# Altium schematic sheet sense_temperature.SchDoc: Sense Temperature
size A4; Date: 27.05.2014; Author: Stefan Lüthi; DrawnBy: Author; Organization: BFH; Address1: Bern University of Applied Sciences; Address2: Engineering and Information Technology; Address3: Jlcoweg 1; Address4: CH-3400 Burgdorf; DocumentNumber: 1; Revision: 1.0; SheetNumber: 3; SheetTotal: 8; CurrentDate: 27.05.2014
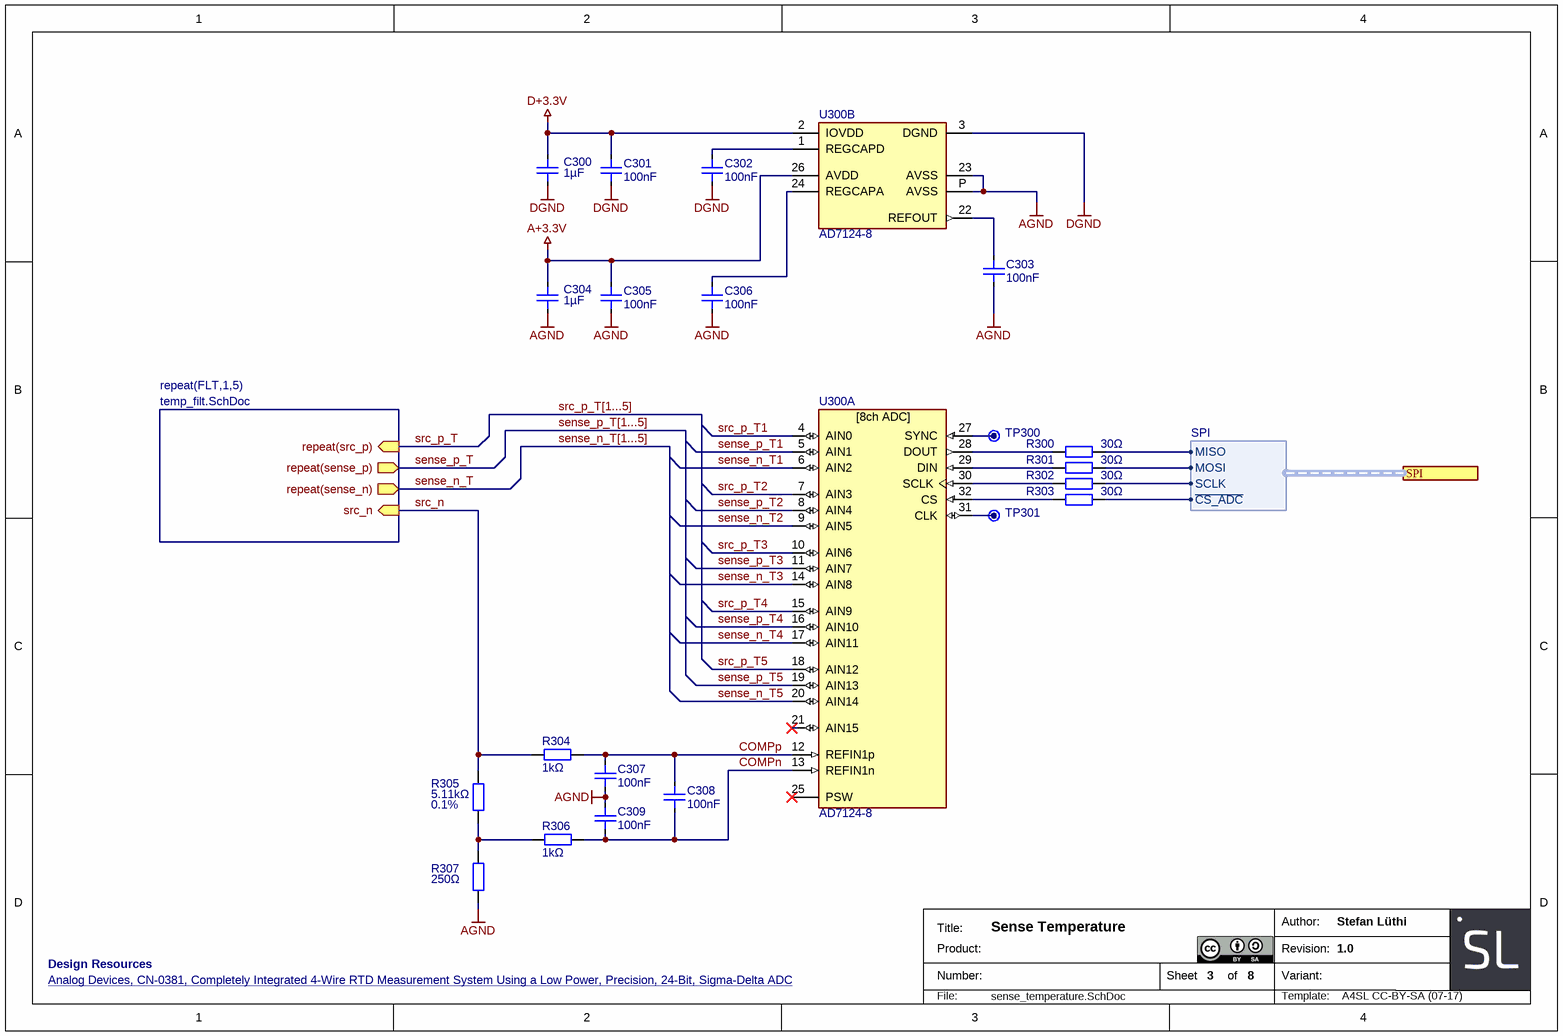
[diagram p0: sense_temperature.SchDoc]

## Parts
C300  1µF  [SMD0603CAP]
C301  100nF  [SMD0603CAP]
C302  100nF  [SMD0603CAP]
C303  100nF  [SMD0603CAP]
C304  1µF  [SMD0603CAP]
C305  100nF  [SMD0603CAP]
C306  100nF  [SMD0603CAP]
C307  100nF  [SMD0603CAP]
C308  100nF  [SMD0603CAP]
C309  100nF  [SMD0603CAP]
R300  30Ω  [SMD0603RES]
R301  30Ω  [SMD0603RES]
R302  30Ω  [SMD0603RES]
R303  30Ω  [SMD0603RES]
R304  1kΩ  [SMD0603RES]
R305  5.11kΩ  precision: 0.1%  [SMD0603RES]
R306  1kΩ  [SMD0603RES]
R307  250Ω  [SMD0603RES]
TP300  Testpoint  [TP]  (value not drawn)  (no BOM)
TP301  Testpoint  [TP]  (value not drawn)  (no BOM)
U300  AD7124-8  [QFN32]  (parts A,B of 2)

## Sub-sheets
repeat(FLT,1,5) = temp_filt.SchDoc: repeat(sense_n) (out), repeat(src_p) (in), src_n (in), repeat(sense_p) (out)

## Ports
SPI (harness SPI)

## Harnesses
SPI: MISO, MOSI, SCLK, ~{CS_ADC}

## Nets
A+3.3V: C304.1 C305.1 U300.26(AVDD)
AGND: C303.2 C304.2 C305.2 C306.2 C307.2 C309.1 R307.1 U300.23(AVSS) U300.P(AVSS)
D+3.3V: C300.1 C301.1 U300.2(IOVDD)
DGND: C300.2 C301.2 C302.2 U300.3(DGND)
COMPn: C308.2 C309.2 R306.1 U300.13(REFIN1n)
COMPp: C307.1 C308.1 R304.1 U300.12(REFIN1p)
sense_n_T: sheet repeat(FLT,1,5)/repeat(sense_n)
sense_n_T1: U300.6(AIN2)
sense_n_T2: U300.9(AIN5)
sense_n_T3: U300.14(AIN8)
sense_n_T4: U300.17(AIN11)
sense_n_T5: U300.20(AIN14)
sense_p_T: sheet repeat(FLT,1,5)/repeat(sense_p)
sense_p_T1: U300.5(AIN1)
sense_p_T2: U300.8(AIN4)
sense_p_T3: U300.11(AIN7)
sense_p_T4: U300.16(AIN10)
sense_p_T5: U300.19(AIN13)
src_n: R304.2 R305.1 ; sheet repeat(FLT,1,5)/src_n
src_p_T: sheet repeat(FLT,1,5)/repeat(src_p)
src_p_T1: U300.4(AIN0)
src_p_T2: U300.7(AIN3)
src_p_T3: U300.10(AIN6)
src_p_T4: U300.15(AIN9)
src_p_T5: U300.18(AIN12)
NetC302_1: C302.1 U300.1(REGCAPD)
NetC303_1: C303.1 U300.22(REFOUT)
NetC306_1: C306.1 U300.24(REGCAPA)
NetR300_1: R300.1 ; port SPI.MISO
NetR300_2: R300.2 U300.28(DOUT)
NetR301_1: R301.1 ; port SPI.MOSI
NetR301_2: R301.2 U300.29(DIN)
NetR302_1: R302.1 ; port SPI.SCLK
NetR302_2: R302.2 U300.30(SCLK)
NetR303_1: R303.1 ; port SPI.~{CS_ADC}
NetR303_2: R303.2 U300.32(CS)
NetR305_2: R305.2 R306.2 R307.2
NetTP300_1: TP300.1 U300.27(SYNC)
NetTP301_1: TP301.1 U300.31(CLK)

Not connected (* = marked no-connect by the designer): U300 21(AIN15)* 25(PSW)*

## Buses and harness runs
bus sense_n_T[1...5]
bus sense_p_T[1...5]
bus src_p_T[1...5]

## Notes on the sheet
- Analog Devices, CN-0381, Completely Integrated 4-Wire RTD Measurement System Using a Low Power, Precision, 24-Bit, Sigma-Delta ADC <https://www.analog.com/media/en/reference-design-documentation/reference-designs/CN0381.pdf>
- Design Resources
- Author:
- Title:
- Number:
- Product:
- Sheet
- of
- Variant:
- Revision:
- File:
- Template:
- A4SL CC-BY-SA (07-17)
- (in symbol AD7124-8, part A) [8ch ADC]

## Library data of the parts
C300-C309 = Capacitor Ceramic: Ceramic Capacitor
R300-R307 = Resistor
U300 = AD7124-8: 8-Channel, Low Noise, Low Power, 24-Bit, Sigma-Delta ADC with PGA and Reference; Supplier 1: Digi-Key; Supplier Part Number 1: AD7124-8BCPZ-ND